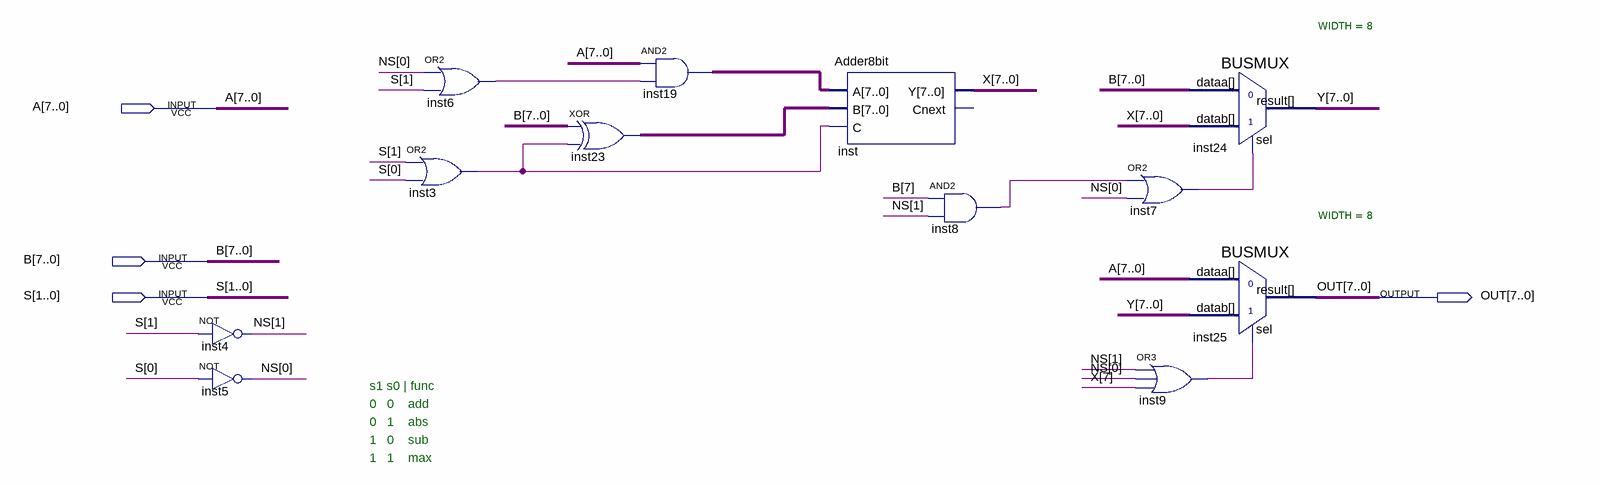
[diagram p0: schematic sheet]
// Quartus schematic TEST.bdf as structural Verilog: 12 symbols, 4 pins
module TEST (
  input  [7:0] A,
  input  [7:0] B,
  input  [1:0] S,
  output [7:0] OUT
);

  wire inst3_out, inst6_out, inst7_out, inst8_out, inst9_out;
  wire [1:0] NS;
  wire [7:0] inst19_out, inst23_out, X, Y;

  not inst4 (NS[1], S[1]);
  not inst5 (NS[0], S[0]);
  or inst6 (inst6_out, NS[0], S[1]);
  or inst3 (inst3_out, S[1], S[0]);
  assign inst23_out = B ^ {8{inst3_out}};  // XOR inst23, 8 bits wide
  assign inst19_out = A & {8{inst6_out}};  // AND2 inst19, 8 bits wide
  Adder8bit inst (.A(inst19_out), .B(inst23_out), .C(inst3_out), .Y(X));  // open: Cnext
  and inst8 (inst8_out, B[7], NS[1]);
  or inst7 (inst7_out, inst8_out, NS[0]);
  or inst9 (inst9_out, NS[1], NS[0], X[7]);
  BUSMUX #(.WIDTH(8)) inst24 (.datab(X), .sel(inst7_out), .dataa(B), .result(Y));
  BUSMUX #(.WIDTH(8)) inst25 (.datab(Y), .sel(inst9_out), .dataa(A), .result(OUT));

  // Notes on the sheet:
  //   s1 s0 | func
  //   0   0    add
  //   0   1    abs
  //   1   0    sub
  //   1   1    max
endmodule
